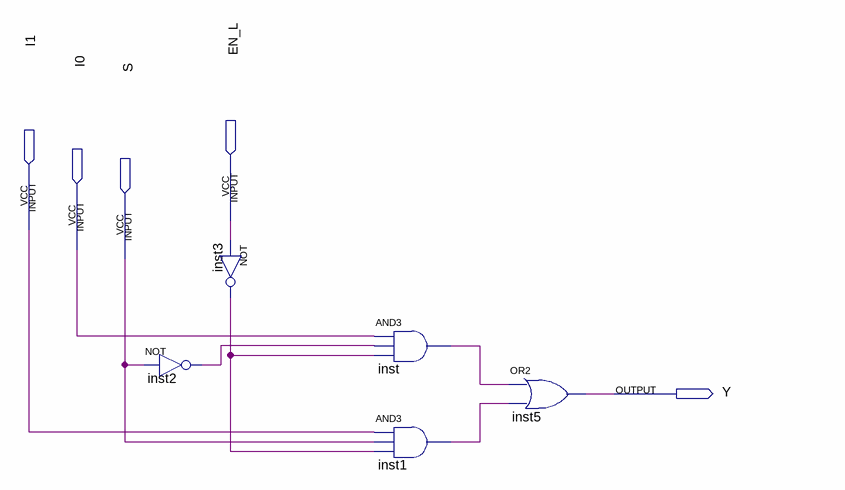
[diagram p0: schematic sheet]
// Quartus schematic Mux2_1.bdf as structural Verilog: 5 symbols, 5 pins
module Mux2_1 (
  input  EN_L,
  input  I1,
  input  I0,
  input  S,
  output Y
);

  wire inst1_out, inst2_out, inst3_out, inst_out;

  not inst2 (inst2_out, S);
  not inst3 (inst3_out, EN_L);
  and inst (inst_out, I0, inst2_out, inst3_out);
  and inst1 (inst1_out, I1, S, inst3_out);
  or inst5 (Y, inst_out, inst1_out);
endmodule
